# EAGLE schematic Demrad_Atron_H24-H28 (EAGLE 6.4)
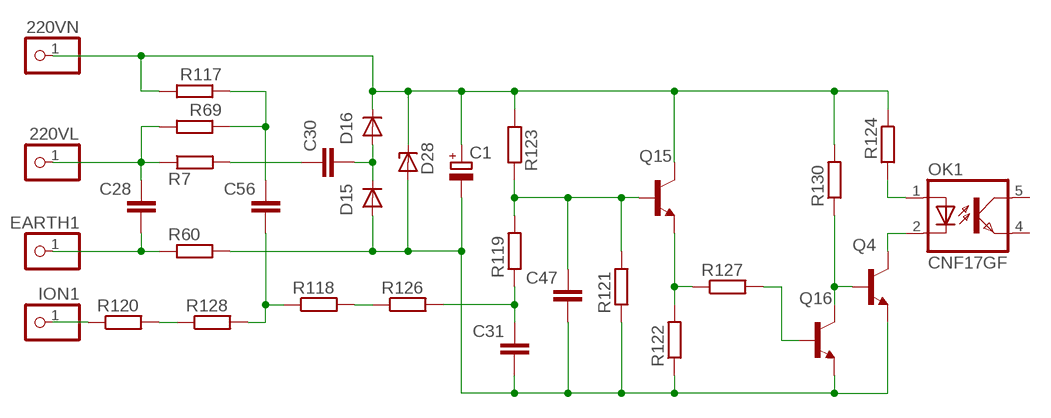
[diagram p0: schematic, sheet 1]

## Parts
220VL  PINHD-1X1  [1X01]
220VN  PINHD-1X1  [1X01]
C1  CPOL-EU085CS-1R  [085CS_1R]
C28  C-EU050-024X044  [C050-024X044]
C30  C-EU050-024X044  [C050-024X044]
C31  C-EU050-024X044  [C050-024X044]
C47  C-EU050-024X044  [C050-024X044]
C56  C-EU050-024X044  [C050-024X044]
D15  1N4004  [DO41-10]
D16  1N4004  [DO41-10]
D28  ZENER-DIODEC1702-15  [C1702-15]
EARTH1  PINHD-1X1  [1X01]
ION1  PINHD-1X1  [1X01]
OK1  CNF17GF  [DIL06B]
Q4  BJT_NPN_TO-92_CBE  [TO92]
Q15  BJT_NPN_TO-92_CBE  [TO92]
Q16  BJT_NPN_TO-92_CBE  [TO92]
R7  R-EU_M0805  [M0805]
R60  R-EU_M0805  [M0805]
R69  R-EU_M0805  [M0805]
R117  R-EU_M0805  [M0805]
R118  R-EU_M0805  [M0805]
R119  R-EU_M0805  [M0805]
R120  R-EU_M0805  [M0805]
R121  R-EU_M0805  [M0805]
R122  R-EU_M0805  [M0805]
R123  R-EU_M0805  [M0805]
R124  R-EU_M0805  [M0805]
R126  R-EU_M0805  [M0805]
R127  R-EU_M0805  [M0805]
R128  R-EU_M0805  [M0805]
R130  R-EU_M0805  [M0805]

## Nets
N$1: Q4.2(B) Q16.1(C) R130.1
N$2: C1.- C31.2 C47.2 D15.A D28.A Q4.3(E) Q16.3(E) R60.2 R121.1 R122.1
N$3: C47.1 Q15.2(B) R119.2 R121.2 R123.1
N$4: R118.2 R126.1
N$5: C31.1 R119.1 R126.2
N$6: Q15.3(E) R122.2 R127.1
N$7: Q16.2(B) R127.2
N$8: OK1.2(C) Q4.1(C)
N$9: OK1.1(A) R124.2
N$10: C28.2 EARTH1.1 R60.1
N$11: C56.2 R118.1 R128.2
N$12: R120.2 R128.1
N$13: ION1.1 R120.1
N$14: 220VN.1 C1.+ D16.C D28.C Q15.1(C) R117.2 R123.2 R124.1 R130.2
N$15: 220VL.1 C28.1 R7.1 R69.2
N$16: C30.1 R7.2
N$17: C30.2 D15.C D16.A
N$19: C56.1 R69.1 R117.1
Unconnected: OK1.4(EMIT) OK1.5(COL)

## Library data of the parts
220VL 220VN EARTH1 ION1 = Разъёмы штырьковые 2.54мм:PINHD-1X1: PIN HEADER
C1 = rcl:CPOL-EU: POLARIZED CAPACITOR, European symbol
C28 C30 C31 C47 C56 = rcl:C-EU: CAPACITOR, European symbol
D15 D16 = diode:1N4004: DIODE general purpose rectifier, 1 A
D28 = diode:ZENER-DIODE: Z-Diode
OK1 = optocoupler:CNF17GF: HEWLETT PACKARD OPTO COUPLER; OC_FARNELL: unknown; OC_NEWARK: unknown
Q4 Q15 Q16 = m_transistor:BJT_NPN: NPN Transistor 13005 - TO-220 BCE КТ805 - TO-220 ECB КТ3102*М - TO-92 CBE КТ201, КТ203, GS109, GS121 - TO-18 EBC МП37 - ТО-5 BC847 - SOT23 BCE
R7 R60 R69 R117-R124 R126-R128 R130 = rcl:R-EU_: RESISTOR, European symbol